# Altium schematic sheet power.SchDoc: EDC_Pro
size A4; SheetNumber: 2; SheetTotal: 2
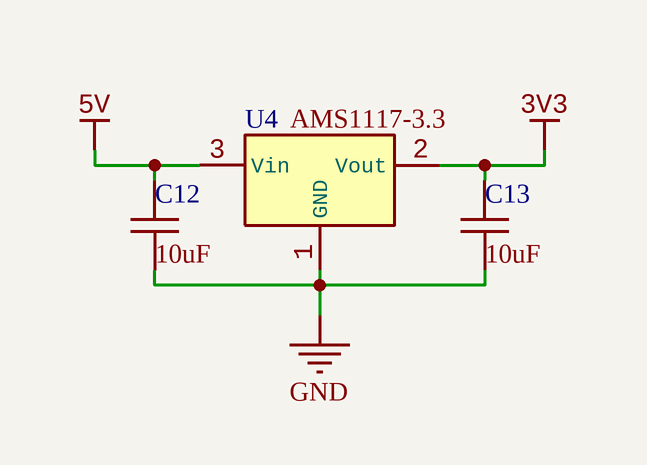
[diagram p0: power.SchDoc]

## Parts
C12  10uF  [C_0805]
C13  10uF  [C_0805]
U4  AMS1117-3.3  [SOT-89-3P]

## Nets
3V3: C13.1 U4.2(Vout)
5V: C12.1 U4.3(Vin)
GND: C12.2 C13.2 U4.1(GND)

## Notes on the sheet
- @attention
  * THE FILE IS ONLY FOR REFERENCE.
- by:bbbbmmdddd
- Title: =Title
- Sheet: =SheetNumber
- File: =DocumentName
- Date: =ModifiedDate
- Size: A4
- Rev: =Revision
- Id: =SheetNumber \ =SheetTotal

## Library data of the parts
C12 C13 = C_MLCC